# EasyEDA Pro project SONIC_TRANSMITTER.epro

# Schematic Rocket_communication_computer
Board Name: Rocket_communication_computer; Create Date: 2025-08-07; Page Name: Sheet_1; Project Name: SONIC; Schematic Name: Rocket_communication_computer; Update Date: 2025-08-09; Add into BOM: yes; Company: Your Company; Convert to PCB: yes; Date: 2025-07-23; Draw By: davdasujal5215; REV: 1.0; Sheet: 1/1; spicePre: .
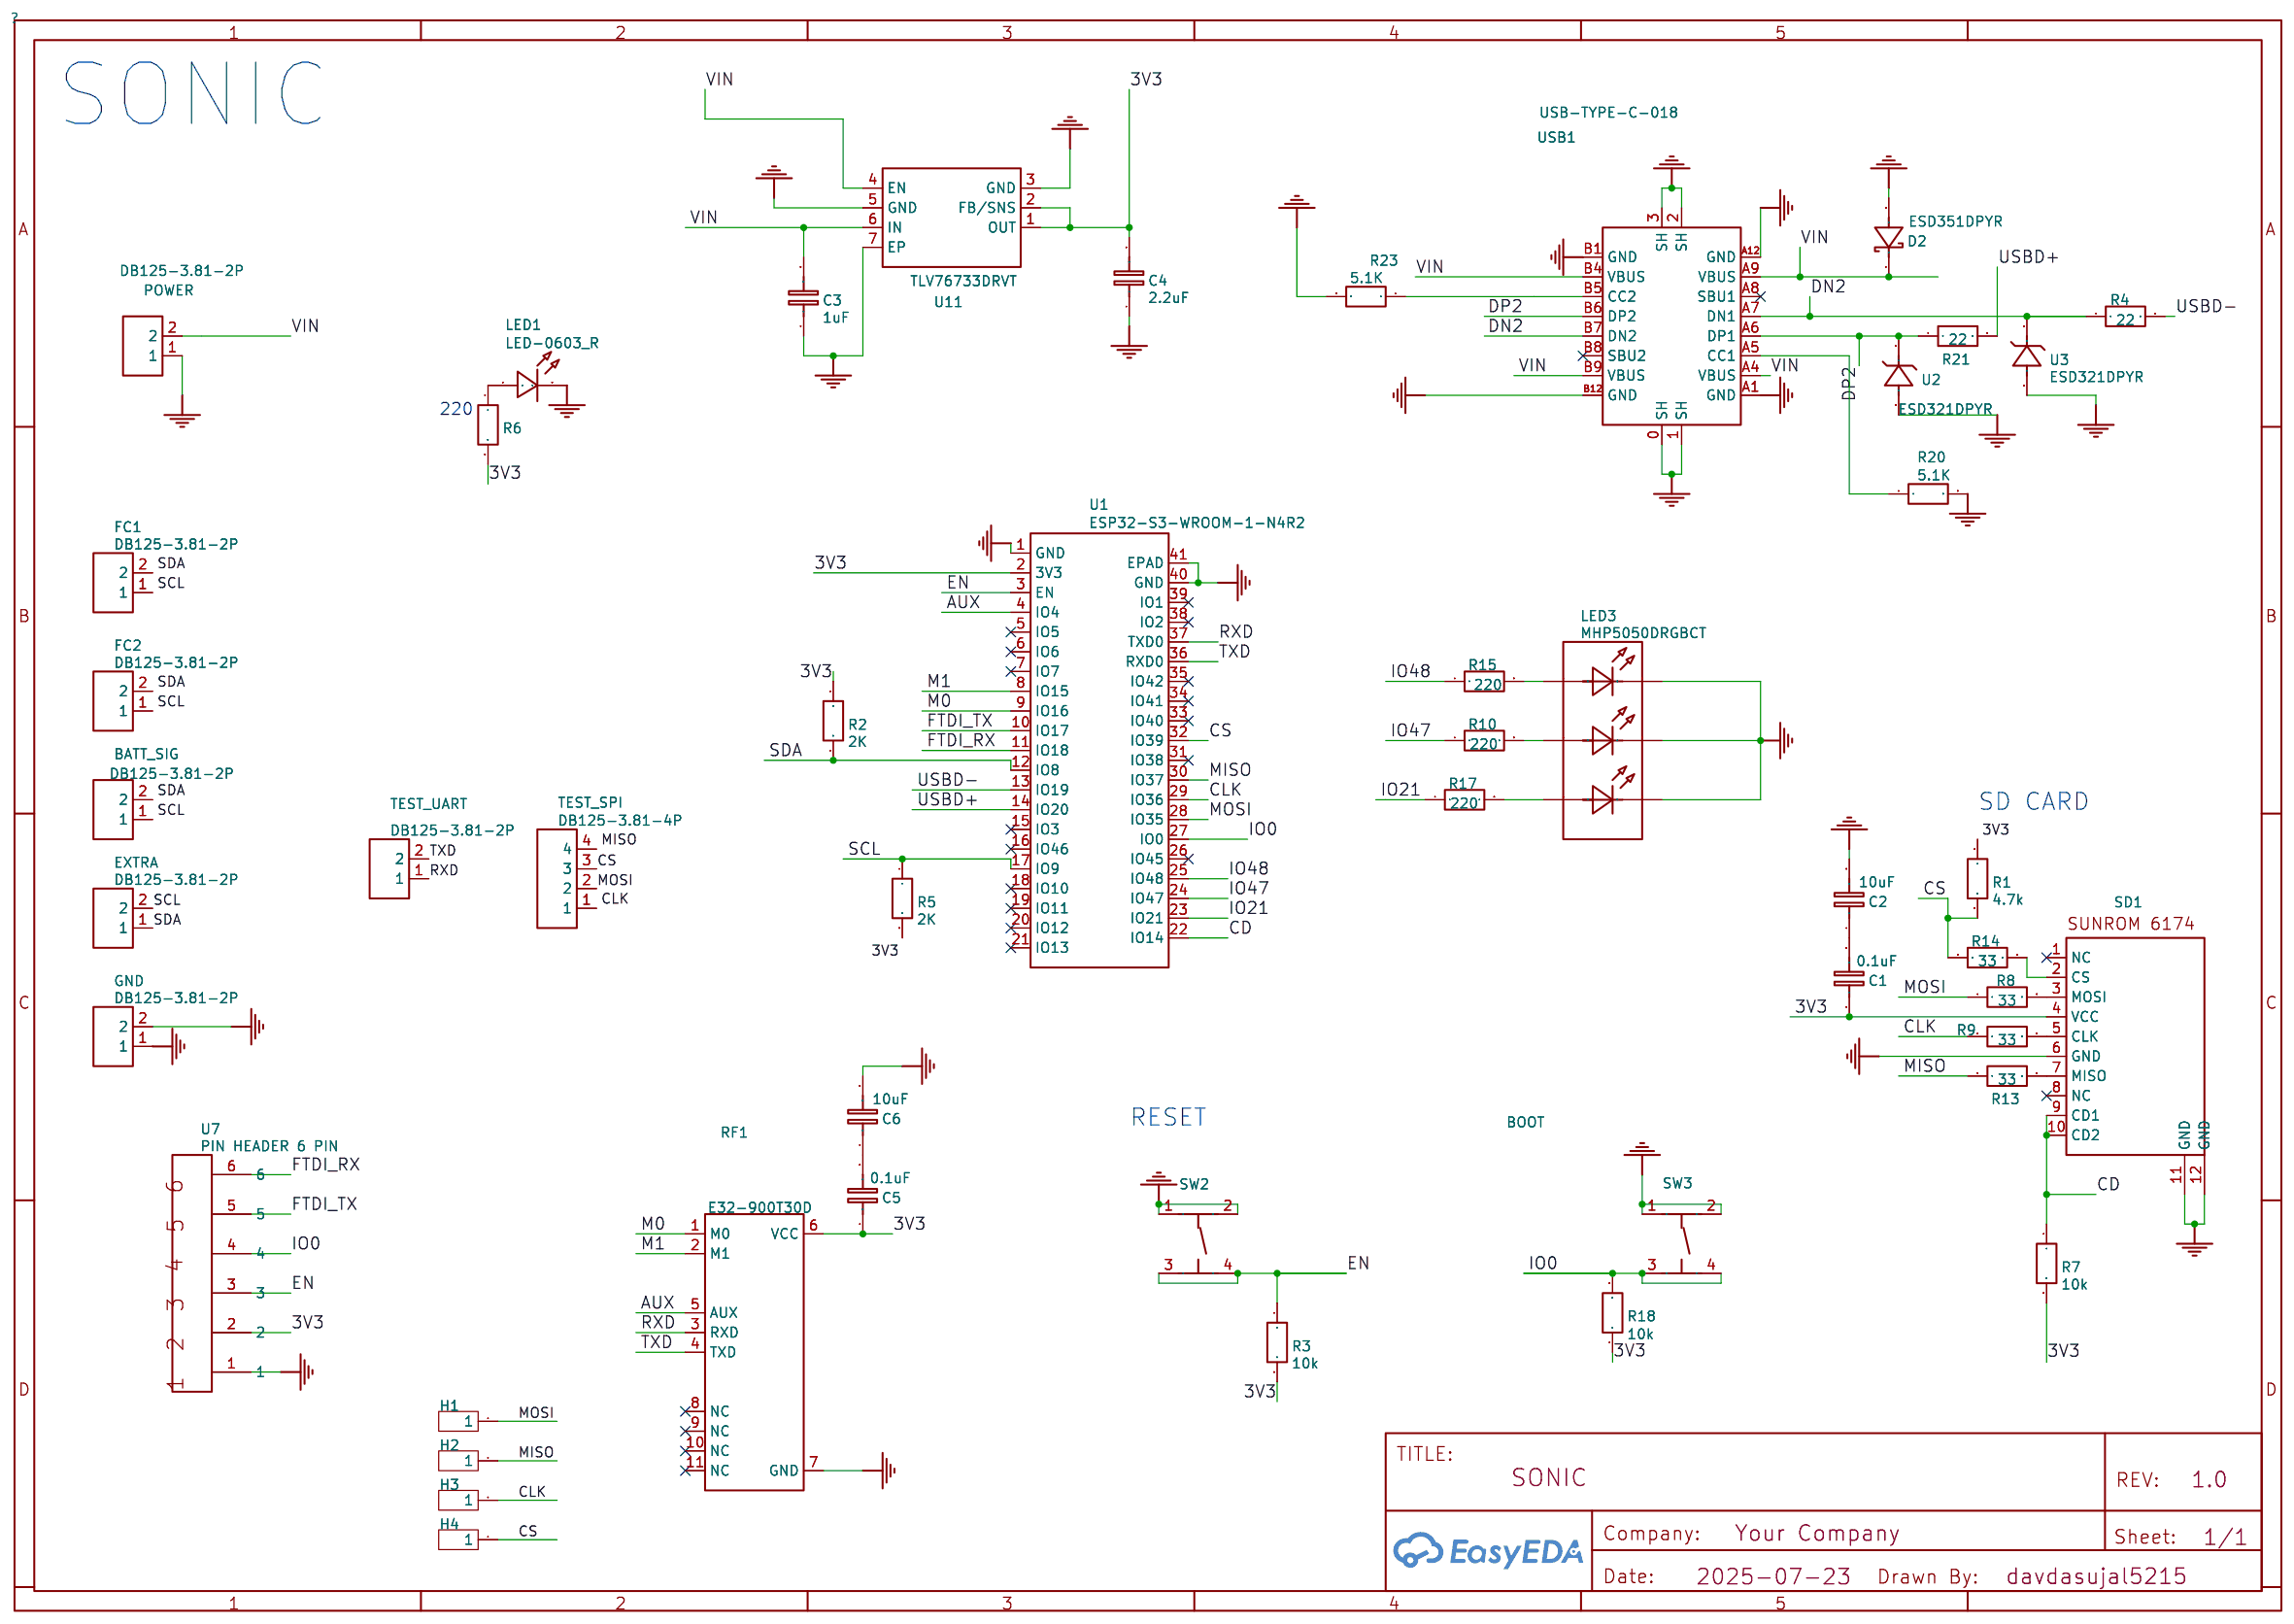
[diagram p0: schematic sheet]

## Parts
BATT_SIG  DB125-3.81-2P  [CONN-TH_2P-P3.81_L7.4-W7.6]
C1  0.1uF  [C0603]
C2  10uF  [C0603]
C3  1uF  [C0603]
C4  2.2uF  [C0603]
C5  0.1uF  [C0603]
C6  10uF  [C0603]
D2  ESD351DPYR  [X1SON-2_L1.0-W0.6-P0.65-RD-1]
EXTRA  DB125-3.81-2P  [CONN-TH_2P-P3.81_L7.4-W7.6]
FC1  DB125-3.81-2P  [CONN-TH_2P-P3.81_L7.4-W7.6]
FC2  DB125-3.81-2P  [CONN-TH_2P-P3.81_L7.4-W7.6]
GND  DB125-3.81-2P  [CONN-TH_2P-P3.81_L7.4-W7.6]
H1  -  [HDR-TH_1P-V-M_XKB_X4611WV-01I-C28D40]
H2  -  [HDR-TH_1P-V-M_XKB_X4611WV-01I-C28D40]
H3  -  [HDR-TH_1P-V-M_XKB_X4611WV-01I-C28D40]
H4  -  [HDR-TH_1P-V-M_XKB_X4611WV-01I-C28D40]
LED1  LED-0603_R  [LED0603_RED]
LED3  MHP5050DRGBCT  [LED-SMD_6P-L5.0-W5.0-P1.60-LS4.4-TL_MHP5050DRGBCT]
POWER  DB125-3.81-2P  [CONN-TH_2P-P3.81_L7.4-W7.6]
R1  4.7k  [R0603]
R2  2K  [R0603]
R3  10k  [R0603]
R4  22  [R0603]
R5  2K  [R0603]
R6  10k  [R0603]
R7  10k  [R0603]
R8  33  [R0603]
R9  33  [R0603]
R10  220  [R0603]
R13  33  [R0603]
R14  33  [R0603]
R15  220  [R0603]
R17  220  [R0603]
R18  10k  [R0603]
R20  5.1K  [R0603]
R21  22  [R0603]
R23  5.1K  [R0603]
RF1  E32-900T30D  [WIRELM-TH_E32-900T30D]
SD1  SUNROM 6174  [SUNROM 6174]
SW2  RESET  [SW-SMD_4P-L4.5-W4.5-P3.00-LS7.0]
SW3  BOOT  [SW-SMD_4P-L4.5-W4.5-P3.00-LS7.0]
TEST_SPI  DB125-3.81-4P  [CONN-TH_DB125-3.81-4P]
TEST_UART  DB125-3.81-2P  [CONN-TH_2P-P3.81_L7.4-W7.6]
U1  ESP32-S3-WROOM-1-N4R2  [WIRELM-SMD_ESP32-S3-WROOM-1]
U2  ESD321DPYR  [X1SON-2_L1.0-W0.6-P0.65-RD]
U3  ESD321DPYR  [X1SON-2_L1.0-W0.6-P0.65-RD]
U7  PIN HEADER 6 PIN  [PINHEADER-6PIN]
U11  TLV76733DRVT  [WSON-6_L2.0-W2.0-P0.65-TL-EP]
USB1  USB-TYPE-C-018  [USB-C_SMD-TYPE-C-31-M-12]

## Library data of the parts
BATT_SIG EXTRA FC1 FC2 GND POWER TEST_UART = DB125-3.81-2P: Supplier: LCSC; Supplier Part: C395878; Manufacturer: DORABO(地博电气); Manufacturer Part: DB125-3.81-2P-GN-S; JLCPCB Part Class: Extended Part; Contributor: LCSC; spicePre: U
C1 C5 = 0.1uF: nameAlias: Value(F); Contributor: LCEDA_Lib; spicePre: C; spiceSymbolName: C_0603_EU
C2 C6 = 10uF: nameAlias: Value(F); Contributor: LCEDA_Lib; spicePre: C; spiceSymbolName: C_0603_EU
C3 = 1uF: nameAlias: Value(F); Contributor: LCEDA_Lib; spicePre: C; spiceSymbolName: C_0603_EU
C4 = 2.2uF: nameAlias: Value(F); Contributor: LCEDA_Lib; spicePre: C; spiceSymbolName: C_0603_EU
D2 = ESD351DPYR: Supplier: LCSC; Supplier Part: C1974929; Manufacturer: TI(德州仪器); JLCPCB Part Class: Extended Part; Contributor: LCSC; spicePre: D
H1-H4 = HDR-M_2.54_1x1P: Supplier Footprint: Through
LED1 = LED-0603_R: Manufacturer: EVERLIGHT(台湾亿光); Manufacturer Part: 19-217/R6C-AL1M2VY/3T; Supplier Part: C72044; Supplier: LCSC; Contributor: LCEDA_01; spicePre: L
LED3 = MHP5050DRGBCT: Supplier: LCSC; Supplier Part: C7470880; Manufacturer: MEIHUA(美华); JLCPCB Part Class: Extended Part; Contributor: lcsc; spicePre: L
R1 = 4.7k: nameAlias: Value(Ω); Contributor: LCEDA_Lib; spicePre: R; spiceSymbolName: R_0603_EU
R2 R5 = 2K: nameAlias: Value(Ω); Contributor: LCEDA_Lib; spicePre: R; spiceSymbolName: R_0603_EU
R3 R6 R7 R18 = 10k: nameAlias: Value(Ω); Contributor: LCEDA_Lib; spicePre: R; spiceSymbolName: R_0603_EU
R4 R21 = 22: nameAlias: Value(Ω); Contributor: LCEDA_Lib; spicePre: R; spiceSymbolName: R_0603_EU
R8 R9 R13 R14 = 33: nameAlias: Value(Ω); Contributor: LCEDA_Lib; spicePre: R; spiceSymbolName: R_0603_EU
R10 R15 R17 = 220: nameAlias: Value(Ω); Contributor: LCEDA_Lib; spicePre: R; spiceSymbolName: R_0603_EU
R20 R23 = 5.1K: nameAlias: Value(Ω); Contributor: LCEDA_Lib; spicePre: R; spiceSymbolName: R_0603_EU
RF1 = E32-900T30D: Supplier: LCSC; Supplier Part: C9900133952; Manufacturer: null; Contributor: lcsc; spicePre: R
SD1 = SUNROM 6174: Contributor: Vanya12345; spicePre: S
SW2 = RESET: Supplier: LCSC; Supplier Part: C397346; Manufacturer: XKB Enterprise; Manufacturer Part: TS-1109S-C-A; JLCPCB Part Class: Extended Part; Contributor: Igor Iks; spicePre: S; spiceSymbolName: TS-1109S-C-A
SW3 = BOOT: Supplier: LCSC; Supplier Part: C397346; Manufacturer: XKB Enterprise; Manufacturer Part: TS-1109S-C-A; JLCPCB Part Class: Extended Part; Contributor: Igor Iks; spicePre: S; spiceSymbolName: TS-1109S-C-A
TEST_SPI = DB125-3.81-4P: Supplier: LCSC; Supplier Part: C395880; Manufacturer: DORABO(地博电气); Manufacturer Part: DB125-3.81-4P-GN-S; JLCPCB Part Class: Extended Part; Contributor: LCSC; spicePre: U
U1 = ESP32-S3-WROOM-1-N4R2: Supplier: LCSC; Supplier Part: C2913203; Manufacturer: ESPRESSIF(乐鑫); JLCPCB Part Class: Extended Part; Contributor: lcsc; spicePre: U
U2 U3 = ESD321DPYR: Supplier: LCSC; Supplier Part: C717890; Manufacturer: null; Contributor: LCSC; spicePre: U
U7 = PIN HEADER 6 PIN: Contributor: iammuria; spicePre: U
U11 = TLV76733DRVT: Supplier: LCSC; Supplier Part: C2867572; Manufacturer: TI(德州仪器); JLCPCB Part Class: Extended Part; Contributor: LCSC; spicePre: U
USB1 = USB-TYPE-C-018: Supplier: LCSC; Supplier Part: C2927038; Manufacturer: DEALON(德艺隆); JLCPCB Part Class: Extended Part; Contributor: LCSC; spicePre: U

## Nets
3V3: C1.1 C4.2 C5.1 R1.1 R2.1 R3.2 R5.2 R6.2 R7.2 R18.1 RF1.6(VCC) SD1.4(VCC) U1.2(3V3) U7.2 U11.1(OUT) U11.2(FB/SNS)
GND: C2.2 C3.1 C4.1 C6.2 D2.2(A) GND.1 GND.2 LED1.2 LED3.4(B-) LED3.5(R-) LED3.6(G-) POWER.1 R20.2 R23.2 RF1.7(GND) SD1.6(GND) SD1.11(GND) SD1.12(GND) SW2.1 SW2.2 SW3.1 SW3.2 U1.1(GND) U1.40(GND) U1.41(EPAD) U2.2(A) U3.2(A) U7.1 U11.3(GND) U11.5(GND) U11.7(EP) USB1.0(SH) USB1.1(SH) USB1.2(SH) USB1.3(SH) USB1.A1(GND) USB1.A12(GND) USB1.B1(GND) USB1.B12(GND)
VIN: C3.2 D2.1(K) POWER.2 U11.4(EN) U11.6(IN) USB1.A4(VBUS) USB1.A9(VBUS) USB1.B4(VBUS) USB1.B9(VBUS)
AUX: RF1.5(AUX) U1.4(IO4)
CD: R7.1 SD1.9(CD1) SD1.10(CD2) U1.22(IO14)
CLK: H3.1 R9.1 TEST_SPI.1 U1.29(IO36)
CS: H4.1 R1.2 R14.1 TEST_SPI.3 U1.32(IO39)
DN2: R4.1 U3.1(K) USB1.A7(DN1) USB1.B7(DN2)
DP2: R21.1 U2.1(K) USB1.A6(DP1) USB1.B6(DP2)
EN: R3.1 SW2.3 SW2.4 U1.3(EN) U7.3
FTDI_RX: U1.11(IO18) U7.6
FTDI_TX: U1.10(IO17) U7.5
IO0: R18.2 SW3.3 SW3.4 U1.27(IO0) U7.4
IO21: R17.1 U1.23(IO21)
IO47: R10.1 U1.24(IO47)
IO48: R15.1 U1.25(IO48)
M0: RF1.1(M0) U1.9(IO16)
M1: RF1.2(M1) U1.8(IO15)
MISO: H2.1 R13.1 TEST_SPI.4 U1.30(IO37)
MOSI: H1.1 R8.1 TEST_SPI.2 U1.28(IO35)
RXD: RF1.3(RXD) TEST_UART.1 U1.37(TXD0)
SCL: BATT_SIG.1 EXTRA.2 FC1.1 FC2.1 R5.1 U1.17(IO9)
SDA: BATT_SIG.2 EXTRA.1 FC1.2 FC2.2 R2.2 U1.12(IO8)
TXD: RF1.4(TXD) TEST_UART.2 U1.36(RXD0)
USBD+: R21.2 U1.14(IO20)
USBD-: R4.2 U1.13(IO19)
$1N37: R14.2 SD1.2(CS)
$1N41: LED3.1(G+) R15.2
$1N65: R20.1 USB1.A5(CC1)
$1N67: R23.1 USB1.B5(CC2)
$1N83: LED3.2(R+) R10.2
$1N84: LED3.3(B+) R17.2
$1N1107: LED1.1 R6.1
$1N1108: R8.2 SD1.3(MOSI)
$1N1109: R9.2 SD1.5(CLK)
$1N1110: R13.2 SD1.7(MISO)
$1N1111: C1.2 C2.1
$1N1118: C5.2 C6.1

Not connected (* = marked no-connect by the designer): RF1 8(NC)* 9(NC)* 10(NC)* 11(NC)*; SD1 1(NC)* 8(NC)*; U1 5(IO5)* 6(IO6)* 7(IO7)* 15(IO3)* 16(IO46)* 18(IO10)* 19(IO11)* 20(IO12)* 21(IO13)* 26(IO45)* 31(IO38)* 33(IO40)* 34(IO41)* 35(IO42)* 38(IO2)* 39(IO1)*; USB1 A8(SBU1)* B8(SBU2)*

## Notes on the sheet
- SONIC
- 220
- SD CARD
- RESET

# Board PCB_Rocket_communication_computer_3
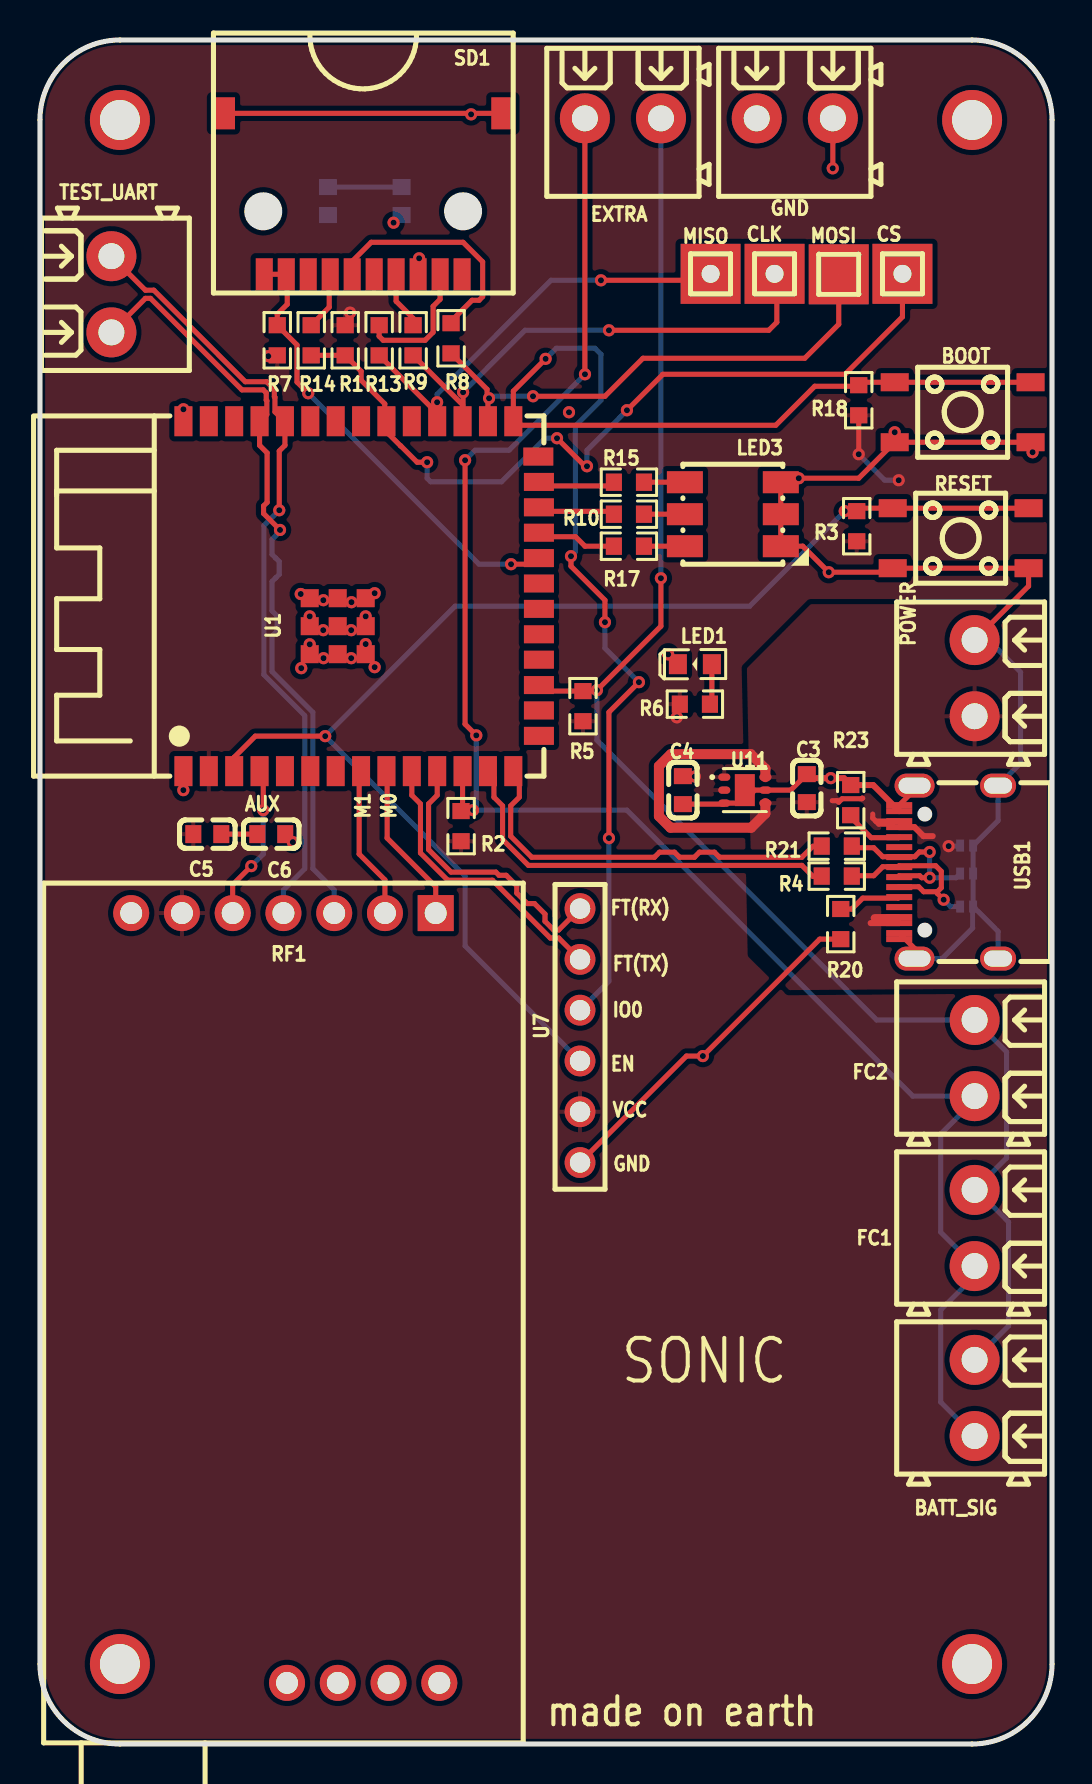
[diagram p1: board, top side]
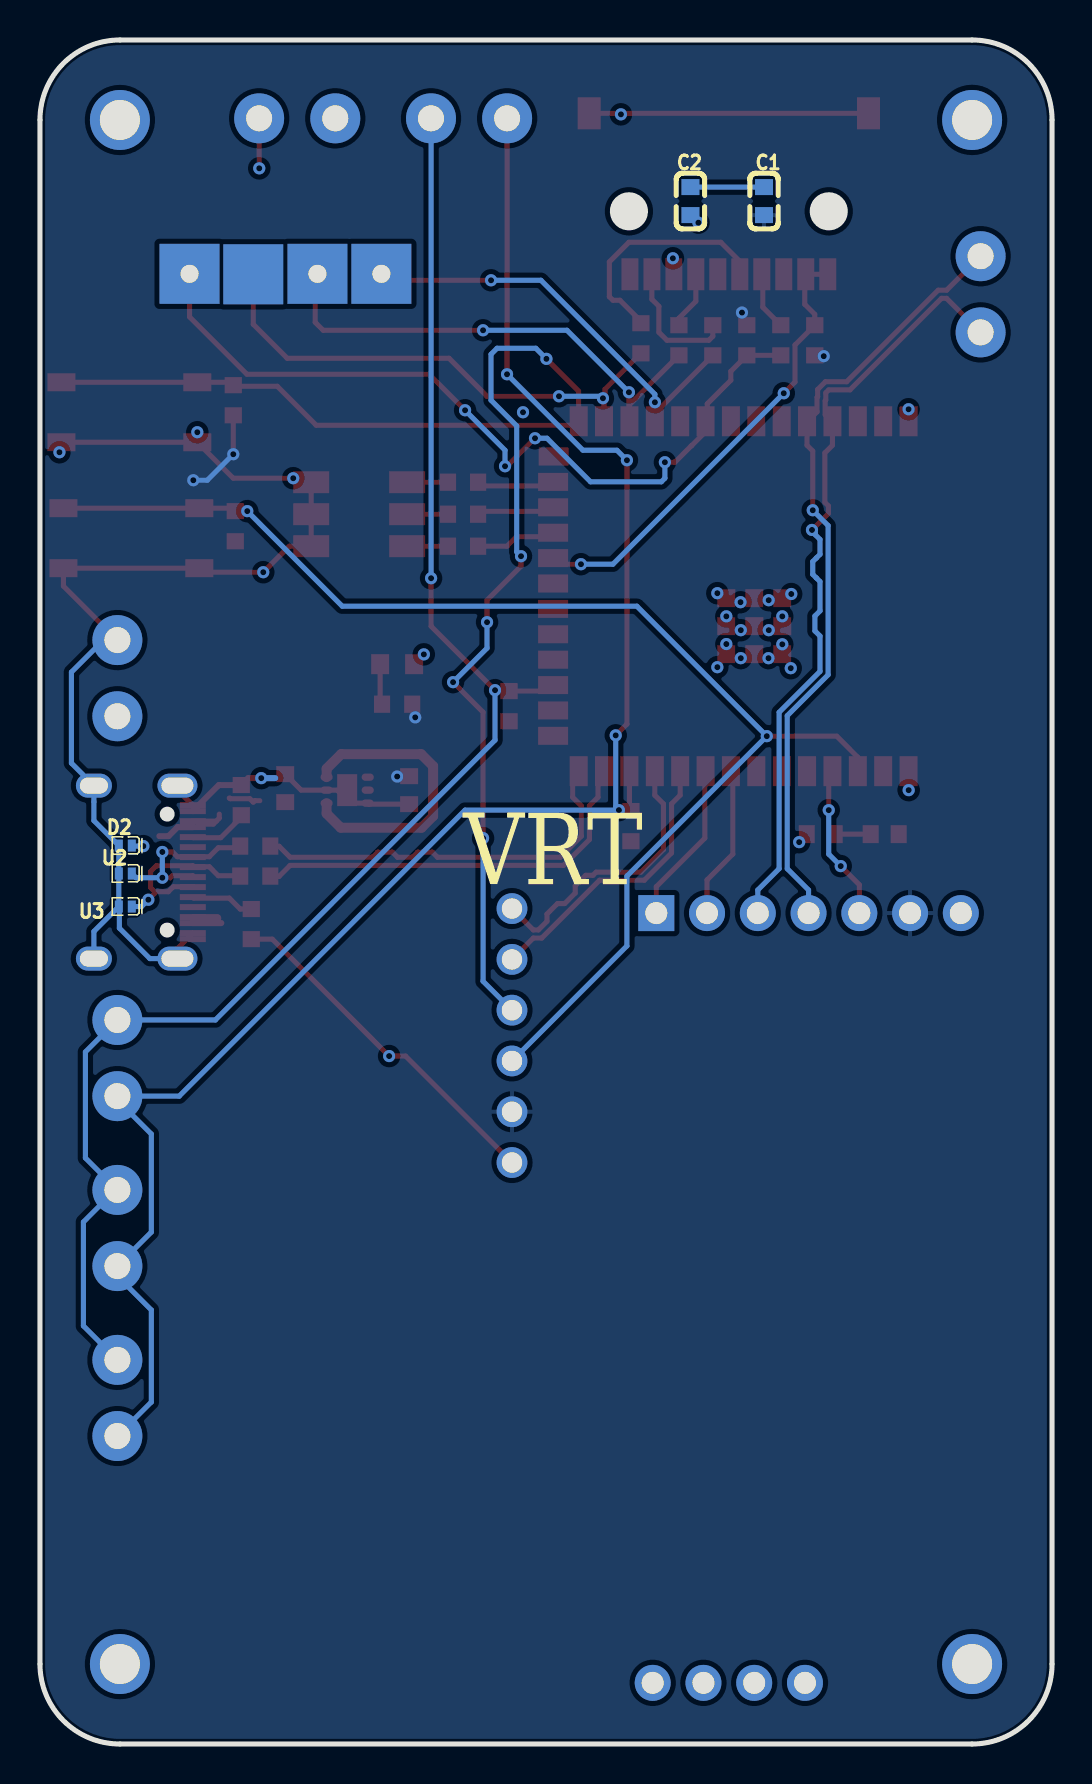
[diagram p2: board, bottom side, seen from below]

Outline 50.65 x 85.23 mm; copper layers: Top Layer, GND, GND2, Bottom Layer. Coordinates in mm from the lower left corner of the outline.
Outline path: 0,81.23 0,4 arc(1.17,1.17) 4,0 46.65,0 arc(49.48,1.17) 50.65,4 50.65,81.23 arc(49.48,84.05) 46.65,85.23 4,85.23 arc(1.17,84.05) 0,81.23
Stack: Top Layer 0.035mm Outer layer thickness 1oz / Dielectric1 0.2104mm 7628 RC49% 8.6mil / GND 0.0152mm Inner layer thickness / Dielectric2 1.065mm 1.1mm H/HOZ Copper / GND2 0.0152mm Inner layer thickness / Dielectric3 0.2104mm 7628 RC49% 8.6mil / Bottom Layer 0.035mm Outer layer thickness 1oz

## Design rules (mm)
net RXD: DP2
net TXD: DP2
net USBD-: DP1
net USBD+: DP1
net FTDI_TX: DP3
net FTDI_RX: DP3
template: JLCPCB Capability(Multiple Layers Board)
spacing copperThickness1oz (default): track to track 0.102, other pairs 0.152 to 0.3
spacing copperThickness2oz: track to track 0.203, other pairs 0.152 to 0.3
spacing copperThicknessInner0.5oz: track to track 0.089, other pairs 0.152 to 0.3
track width copperThickness1oz (default): min 0.102, default 0.254, max 2.54
track width copperThickness0.5oz: min 0.089, default 0.254, max 2.54
track width copperThickness2oz: min 0.203, default 0.254, max 2.54
differential pair differentialPair (default): width min 0.127, default 0.254, max 2.54; gap min 0.152, default 0.152
via viaSize (default): diameter min 0.3, default 0.61, max 10; hole min 0.2, default 0.305, max 6.3

## Placement (name value [footprint] x y rotation side)
BATT_SIG  DB125-3.81-2P  [CONN-TH_2P-P3.81_L7.4-W7.6]  46.78 17.31 270 top
BOOT  BOOT  [SW-SMD_4P-L4.5-W4.5-P3.00-LS7.0]  46.18 66.61 180 top
C1  0.1uF  [C0603]  14.41 77.17 90 bottom
C2  10uF  [C0603]  18.1 77.17 270 bottom
C3  1uF  [C0603]  38.38 47.81 270 top
C4  2.2uF  [C0603]  32.18 47.71 90 top
C5  0.1uF  [C0603]  8.38 45.51 0 top
C6  10uF  [C0603]  11.57 45.51 0 top
CLK  -  [HDR-TH_1P-V-M_XKB_X4611WV-01I-C28D40]  36.76 73.53 0 top
CS  -  [HDR-TH_1P-V-M_XKB_X4611WV-01I-C28D40]  43.16 73.53 180 top
D2  ESD351DPYR  [X1SON-2_L1.0-W0.6-P0.65-RD-1]  46.38 44.94 0 bottom
EXTRA  DB125-3.81-2P  [CONN-TH_2P-P3.81_L7.4-W7.6]  29.18 81.31 0 top
FC1  DB125-3.81-2P  [CONN-TH_2P-P3.81_L7.4-W7.6]  46.78 25.81 270 top
FC2  DB125-3.81-2P  [CONN-TH_2P-P3.81_L7.4-W7.6]  46.78 34.31 270 top
GND  DB125-3.81-2P  [CONN-TH_2P-P3.81_L7.4-W7.6]  37.78 81.31 0 top
LED1  LED-0603_R  [LED0603_RED]  32.78 54.01 180 top
LED3  MHP5050DRGBCT  [LED-SMD_6P-L5.0-W5.0-P1.60-LS4.4-TL_MHP5050DRGBCT]  34.68 61.51 0 top
MISO  -  [HDR-TH_1P-V-M_XKB_X4611WV-01I-C28D40]  33.56 73.53 180 top
MOSI  -  [HDR-TH_1P-V-M_XKB_X4611WV-01I-C28D40#2]  39.97 73.51 0 top
NOREF  -  [Pad_e596]  4 4 0 top
NOREF#2  -  [Pad_e594]  46.65 81.23 0 top
NOREF#3  -  [Pad_e11]  46.65 4 0 top
NOREF#4  -  [Pad_e595]  4 81.23 0 top
POWER  DB125-3.81-2P  [CONN-TH_2P-P3.81_L7.4-W7.6]  46.78 53.31 270 top
R1  4.7k  [R0603]  15.28 70.21 270 top
R2  2K  [R0603]  21.07 45.91 90 top
R3  10k  [R0603]  40.88 60.91 270 top
R4  22  [R0603]  39.88 43.41 180 top
R5  2K  [R0603]  27.18 51.91 270 top
R6  10k  [R0603]  32.78 52.01 180 top
R7  10k  [R0603]  11.88 70.21 270 top
R8  33  [R0603]  20.57 70.31 90 top
R9  33  [R0603]  18.68 70.21 90 top
R10  220  [R0603]  29.47 61.51 0 top
R13  33  [R0603]  16.97 70.21 90 top
R14  33  [R0603]  13.57 70.21 90 top
R15  220  [R0603]  29.47 63.11 0 top
R17  220  [R0603]  29.47 59.91 0 top
R18  10k  [R0603]  40.97 67.21 90 top
R20  5.1K  [R0603]  40.07 41.01 270 top
R21  22  [R0603]  39.88 44.91 180 top
R23  5.1K  [R0603]  40.57 47.21 90 top
RESET  RESET  [SW-SMD_4P-L4.5-W4.5-P3.00-LS7.0]  46.07 60.31 180 top
RF1  E32-900T30D  [WIRELM-TH_E32-900T30D]  12.28 22.31 0 top
SD1  -  [SUNROM 6174]  16.18 73.51 0 top
TEST_UART  DB125-3.81-2P  [CONN-TH_2P-P3.81_L7.4-W7.6]  3.58 72.51 90 top
U1  ESP32-S3-WROOM-1-N4R2  [WIRELM-SMD_ESP32-S3-WROOM-1]  16.07 57.41 90 top
U2  ESD321DPYR  [X1SON-2_L1.0-W0.6-P0.65-RD]  46.38 43.54 0 bottom
U3  ESD321DPYR  [X1SON-2_L1.0-W0.6-P0.65-RD]  46.38 41.89 0 bottom
U7  PIN HEADER 6 PIN  [PINHEADER-6PIN]  27.03 29.08 90 top
U11  TLV76733DRVT  [WSON-6_L2.0-W2.0-P0.65-TL-EP]  35.28 47.71 0 top
USB1  USB-TYPE-C-018  [USB-C_SMD-TYPE-C-31-M-12]  45.47 43.61 90 top

## Footprints (pads in the part's own frame, mm; a bottom-side part is the same pattern mirrored in y, then rotated)
C0603
  rect 0.8x0.9 smd: 1(-0.7,0) 2(0.7,0)
CONN-TH_2P-P3.81_L7.4-W7.6
  round 2.5 hole 1.3: 1(-1.905,0) 2(1.905,0)
HDR-TH_1P-V-M_XKB_X4611WV-01I-C28D40
  rect 3x3 hole 0.9x0.003: 1(0,0)
HDR-TH_1P-V-M_XKB_X4611WV-01I-C28D40#2
  rect 3x3 hole 0.003: 1(0,0)
LED0603_RED
  rect 0.9x1 smd: 1(-0.85,0) 2(0.85,0)
LED-SMD_6P-L5.0-W5.0-P1.60-LS4.4-TL_MHP5050DRGBCT
  rect 1.8x1.1 smd: 1(-2.4,1.6) 2(-2.4,0) 3(-2.4,-1.6) 4(2.4,-1.6) 5(2.4,0) 6(2.4,1.6)
Pad_e11
  round 3 hole 2: 1(0,0)
Pad_e594
  round 3 hole 2: 1(0,0)
Pad_e595
  round 3 hole 2: 1(0,0)
Pad_e596
  round 3 hole 2: 1(0,0)
PINHEADER-6PIN
  round 1.54 hole 1.02: 1(0,0) 2(2.54,0) 3(5.08,0) 4(7.62,0) 5(10.16,0) 6(12.7,0)
R0603
  rect 0.806x0.864 smd: 1(-0.753,0) 2(0.753,0)
SUNROM 6174
  custom 0.85x1.6 smd: 1(-2.75,0) 2(-1.65,0) 3(-0.55,0) 4(0.55,0) 5(1.65,0) 6(2.75,0) 7(3.85,0) 8(4.95,0) 9(-4.95,0) 10(-3.85,0)
  custom 1.15x1.6 smd: 11(-6.99,8.05) 12(6.99,8.05)
SW-SMD_4P-L4.5-W4.5-P3.00-LS7.0
  rect 1.4x0.9 smd: 1(-3.4,1.5) 2(3.4,1.5) 3(-3.4,-1.5) 4(3.4,-1.5)
USB-C_SMD-TYPE-C-31-M-12
  oval 1.2x2 hole 0.8x1.6: 0(-4.325,1.706) 1(4.325,1.706)
  oval 1.2x1.8 hole 0.8x1.4: 2(4.325,-2.474) 3(-4.325,-2.474)
  rect 0.3x1.3 smd: A1(-3.35,2.474) A4(-2.55,2.474) A5(-1.25,2.474) A6(-0.25,2.474) A7(0.25,2.474) A8(1.25,2.474) A9(2.55,2.474) A12(3.35,2.474) B1(3.05,2.474) B4(2.25,2.474) B5(1.75,2.474) B6(0.75,2.474) B7(-0.75,2.474) B8(-1.75,2.474) B9(-2.25,2.474) B12(-3.05,2.474)
WIRELM-SMD_ESP32-S3-WROOM-1
  rect 1.5x0.9 smd: 1(-8.75,8.895) 2(-8.75,7.625) 3(-8.75,6.355) 4(-8.75,5.085) 5(-8.75,3.815) 6(-8.75,2.545) 7(-8.75,1.275) 8(-8.75,0.005) 9(-8.75,-1.265) 10(-8.75,-2.535) 11(-8.75,-3.805) 12(-8.75,-5.075) 13(-8.75,-6.345) 14(-8.75,-7.615) 27(8.75,-7.615) 28(8.75,-6.345) 29(8.75,-5.075) 30(8.75,-3.805) 31(8.75,-2.535) 32(8.75,-1.265) 33(8.75,0.005) 34(8.75,1.275) 35(8.75,2.545) 36(8.75,3.815) 37(8.75,5.085) 38(8.75,6.355) 39(8.75,7.625) 40(8.75,8.895)
  rect 0.9x1.5 smd: 15(-6.985,-8.895) 16(-5.715,-8.895) 17(-4.445,-8.895) 18(-3.175,-8.895) 19(-1.905,-8.895) 20(-0.635,-8.895) 21(0.635,-8.895) 22(1.905,-8.895) 23(3.175,-8.895) 24(4.445,-8.895) 25(5.715,-8.895) 26(6.985,-8.865)
  rect 0.9x0.9 smd: 41(-2.9,2.575) 41(-2.9,1.175) 41(-2.9,-0.225) 41(-1.5,2.575) 41(-1.5,1.175) 41(-1.5,-0.226) 41(-0.1,2.575) 41(-0.1,1.175) 41(-0.1,-0.225)
WIRELM-TH_E32-900T30D
  rect 1.8x1.8 hole 1.1: 1(7.53,19.25)
  round 1.8 hole 1.1: 2(4.99,19.25) 3(2.45,19.25) 4(-0.09,19.25) 5(-2.63,19.25) 6(-5.17,19.25) 7(-7.71,19.25) 8(0.09,-19.25) 9(2.63,-19.25) 10(5.17,-19.25) 11(7.71,-19.25)
WSON-6_L2.0-W2.0-P0.65-TL-EP
  oval 0.607x0.364 smd: 1(-1.028,0.65) 2(-1.028,0) 3(-1.028,-0.65) 4(1.028,-0.65) 5(1.028,0) 6(1.028,0.65)
  rect 1x1.6 smd: 7(0,0)
X1SON-2_L1.0-W0.6-P0.65-RD
  rect 0.4x0.6 smd: 1(-0.325,0) 2(0.325,0)
X1SON-2_L1.0-W0.6-P0.65-RD-1
  rect 0.4x0.6 smd: 1(-0.325,0) 2(0.325,0)

## Nets
As in the schematic, except:
GND: BOOT.1 BOOT.2 C2.2 C3.1 C4.1 C6.2 D2.2 GND.1 GND.2 LED1.2 LED3.4 LED3.5 LED3.6 POWER.1 R20.2 R23.2 RESET.1 RESET.2 RF1.7 SD1.6 SD1.11 SD1.12 U1.1 U1.40 U1.41 U2.2 U3.2 U7.1 U11.3 U11.5 U11.7 USB1.0 USB1.1 USB1.2 USB1.3 USB1.A1 USB1.A12 USB1.B1 USB1.B12
CLK: CLK.1 R9.1 U1.29
CS: CS.1 R1.2 R14.1 U1.32
EN: R3.1 RESET.3 RESET.4 U1.3 U7.3
IO0: BOOT.3 BOOT.4 R18.2 U1.27 U7.4
MISO: MISO.1 R13.1 U1.30
MOSI: MOSI.1 R8.1 U1.28

Pads without a net: NOREF 1; NOREF#2 1; NOREF#3 1; NOREF#4 1; RF1 8 9 10 11; SD1 1 8; U1 5 6 7 15 16 18 19 20 21 26 31 33 34 35 38 39; USB1 A8 B8

## Via types
v1: diameter 0.61, hole 0.305, Top Layer to Bottom Layer, 68 vias

## Routing (per net, layer and track width the routed paths; a pad name or vN(x,y) marks a point on that pad's centre or on a via; arc(x,y) is an arc through that point)
3V3: length 4.5
  Top Layer w0.254: R18.1 v1(40.97,64.51)
  Bottom Layer w0.254: v1(40.97,64.51) 42.28,63.21 v1(42.97,63.21)
  vias: v1(11.43,69.41) v1(15.52,71.59) v1(31.87,51.35) v1(32.77,48.39)
GND: length 105.9
  Top Layer w0.254: v1(37.97,63.31) 40.97,63.31 BOOT.2 BOOT.1 ; C3.1 37.57,47.71 U11.5 35.78,47.71 35.12,47.06 U11.3 34.2,47.01 C4.1 ; USB1.B12 43.77,39.79 43.77,39.28 ; SD1.12 21.62,81.56 v1(21.57,81.51) 21.53,81.56 SD1.11 ; USB1.1 43.77,47.73 USB1.A12 ; LED3.6 LED3.5 LED3.4 38.18,59.91 v1(39.47,58.61) 42.47,58.61 RESET.2 RESET.1 49.47,57.91 POWER.1 ; GND.2 39.68,78.81 v1(39.68,78.81) ; R20.2 39.02,40.25 v1(33.18,34.41) 32.35,34.41 U7.1
  Top Layer w0.3: USB1.B1 41.7,47.96 R23.2 40.23,48.31 v1(39.57,48.31) ; 38.88,48.31 39.38,48.31
  Bottom Layer w0.254: 47.95,39.28 47.95,40.64 U3.2 ; U3.2 46.68,41.86 46.68,40.81 45.15,39.28 43.77,39.28 ; U3.2 U2.2 D2.2 47.95,46.18 USB1.2 49.07,49.06 49.07,53.61 47.47,55.21 POWER.1
  Bottom Layer w0.3: v1(39.57,48.31) 38.88,48.31
  vias: v1(7.18,66.76) v1(7.17,47.71) v1(12.66,45.11) v1(13.05,57.52) v1(13.07,53.81) v1(13.5,56.4) v1(13.5,55) v1(14.18,57.21) v1(14.18,55.71) v1(14.19,54.31) v1(15.59,57.11) v1(15.57,55.71) v1(15.57,54.31) v1(16.3,56.4) v1(16.3,55.01) v1(16.75,57.56) v1(16.75,53.86) v1(17.7,76.09) v1(18.97,74.31) v1(31.44,54.5) v1(42.78,65.61) v1(49.68,64.61)
VIN: length 24.7
  Top Layer w0.254: USB1.A9 41.82,46.16 ; 41.82,46.16 41.97,46.01 42.68,46.01 ; 41.82,46.16 41.68,46.31 41.68,46.51 ; 41.18,47.31 41.15,47.31 41.12,47.28 40.15,47.28 39.97,47.11 39.9,47.18 39.65,47.18 ; USB1.B4 42.68,45.86
  Top Layer w0.3: USB1.B4 43.76,45.86 44.21,45.41 44.68,45.41
  Top Layer w0.305: USB1.A4 41.57,41.06
  Top Layer w0.4: 42.95,41.31 41.78,41.31
  Top Layer w0.5: U11.4 36.3,46.54 35.6,45.83 31.55,45.83 30.97,46.41 30.97,48.91 31.57,49.51 35.57,49.51 36.3,48.78 U11.6
  Bottom Layer w0.254: D2.1 46.03,44.91 v1(45.47,44.91)
(no net):
  vias: v1(26.47,66.61)
AUX: length 7.7
  Top Layer w0.254: 10.99,48.46 11.18,48.27 v1(11.18,46.71) ; 9.64,41.46 9.64,42.98 v1(10.57,43.91)
  Bottom Layer w0.254: v1(11.18,46.71) 11.18,44.51 v1(10.57,43.91)
CD: length 23.3
  Top Layer w0.254: v1(13.43,67.56) 12.86,68.12 12.86,69.97 R7.1 11.88,71.51 12.38,72.01 12.38,73.46 SD1.10 SD1.9 ; v1(23.57,59.01) 25.26,59.01 25.27,59.01
  Bottom Layer w0.254: v1(13.43,67.56) 21.97,59.01 v1(23.57,59.01)
CLK: length 25.8
  Top Layer w0.254: CLK.1 36.88,73.42 36.88,71.11 36.47,70.71 v1(28.47,70.71) ; R9.1 21.15,66.98 21.15,65.96 21.18,65.98 v1(21.18,67.61)
  Bottom Layer w0.254: v1(28.47,70.71) 24.28,70.71 v1(21.18,67.61)
CS: length 40.9
  Top Layer w0.254: v1(25.88,65.31) 27.28,63.91 v1(27.38,63.91) ; R14.1 R1.2 16.07,68.65 16.07,68.21 17.25,67.03 17.25,66.04 17.34,65.96 17.34,65.63 18.04,64.93 18.05,64.93 18.88,64.11 v1(19.38,64.11) ; CS.1 43.16,71.38 40.29,68.51 31.18,68.51 v1(29.38,66.71)
  Bottom Layer w0.254: v1(29.38,66.71) 27.38,64.71 v1(27.38,63.91) ; v1(19.38,64.11) 19.38,63.31 19.55,63.13 23.1,63.13 25.28,65.31 v1(25.88,65.31)
DN2: length 9.3
  Top Layer w0.254: 40.84,43.4 40.88,43.43 41.72,43.43 42.18,43.88 42.95,43.88 43,43.93 44.82,43.93 45.11,43.64 45.11,42.83 44.91,42.63 ; 44.91,42.63 44.91,42.54 v1(45.22,42.23) ; 44.91,42.63 44.22,42.63 43.97,42.88 42.95,42.88
  Bottom Layer w0.254: v1(45.22,42.23) 45.57,41.89 U3.1
DP2: length 8.6
  Top Layer w0.254: v1(44.53,43.33) 44.12,43.33 44.03,43.43 43,43.43 42.95,43.38 ; v1(44.53,44.62) 44.01,44.62 43.78,44.38 42.18,44.38 41.72,44.83 40.91,44.83 40.84,44.9
  Bottom Layer w0.254: 44.43,44.62 44.53,44.52 v1(44.53,43.33) 45.84,43.33 U2.1
EN: length 67.3
  Top Layer w0.254: v1(40.28,61.66) R3.1 41.02,61.81 RESET.4 RESET.3 ; 9.72,48.46 9.72,49.35 10.78,50.41 v1(14.28,50.41)
  Bottom Layer w0.254: v1(40.28,61.66) 35.52,56.91 20.78,56.91 v1(14.28,50.41) 21.28,43.41 21.28,39.92 U7.3
FTDI_RX: length 14
  Top Layer w0.254: U7.6 25.96,40.72 25.71,40.72 25.28,41.15 25.28,41.51 24.75,42.03 24.39,42.03 23.86,42.56 23.86,42.92 23.33,43.45 22.97,43.45 22.81,43.61 20.57,43.61 19.45,44.74 19.45,47.02 19.88,47.45 19.88,48.46
FTDI_TX: length 14.3
  Top Layer w0.254: U7.5 25.96,40.31 25.54,40.31 22.65,43.2 20.41,43.2 19.04,44.57 19.04,47.02 18.61,47.45 18.61,48.46
IO0: length 69.9
  Top Layer w0.254: v1(28.47,45.31) 28.47,51.61 v1(29.97,53.11) ; v1(25.3,69.28) 23.69,67.66 23.69,65.96 36.82,65.96 38.78,67.91 40.92,67.91 R18.2 41.12,68.11 BOOT.4 BOOT.3 ; v1(28.28,56.11) 28.28,57.21 26.57,58.91 v1(26.57,59.41)
  Bottom Layer w0.254: U7.4 28.47,38.15 v1(28.47,45.31) ; v1(25.3,69.28) 25.83,69.81 27.78,69.81 28.07,69.51 28.07,67.21 26.79,65.92 26.79,59.62 v1(26.57,59.41) ; v1(28.28,56.11) 28.28,54.81 v1(29.97,53.11)
IO21: length 3.9
  Top Layer w0.254: 24.97,60.38 26.8,60.38 27.28,59.91 R17.1
IO47: length 3.8
  Top Layer w0.254: R10.1 28.58,61.65 24.97,61.65
IO48: length 3.8
  Top Layer w0.254: 24.97,62.92 28.54,62.92 R15.1
M0: length 7.9
  Top Layer w0.254: 17.34,48.46 17.38,48.42 17.38,45.31 19.81,42.88 RF1.1
M1: length 7.5
  Top Layer w0.254: RF1.2 17.26,43.22 15.97,44.51 15.97,48.36 16.07,48.46
MISO: length 21.8
  Top Layer w0.254: MISO.1 33.24,73.21 v1(28.07,73.21) ; 19.88,65.96 19.88,65.96 19.88,66.55 ; R13.1 19.88,66.55 ; 19.88,66.55 v1(19.88,67.11)
  Bottom Layer w0.254: v1(19.88,67.11) 19.88,67.51 25.57,73.21 v1(28.07,73.21)
MOSI: length 25.9
  Top Layer w0.254: v1(24.68,67.41) 28.28,67.41 30.18,69.31 38.28,69.31 39.97,71.01 MOSI.1 ; 22.42,65.96 22.42,67.25 v1(22.47,67.31) ; 22.38,67.31 22.38,67.75 R8.1
  Bottom Layer w0.254: v1(24.68,67.41) 22.57,67.41 v1(22.47,67.31)
RXD: length 39.1
  Top Layer w0.254: v1(12.01,60.72) 11.19,61.54 11.19,61.92 11.37,62.1 11.37,64.58 10.99,64.95 10.99,66.13 11.35,66.49 11.35,67.19 11.32,67.22 11.32,67.58 11.18,67.73 10.11,67.73 5.53,72.31 5.28,72.31 TEST_UART.1
  Bottom Layer w0.254: v1(12.01,60.72) 11.84,60.55 11.84,60.48 11.61,60.25 11.61,59.5 11.79,59.32 11.8,59.32 11.97,59.14 11.97,58.5 11.8,58.32 11.79,58.32 11.61,58.14 11.61,56.67 11.87,56.42 11.87,55.67 11.61,55.42 11.61,53.65 13.66,51.6 13.66,43.78 14.72,42.71 RF1.3
SCL: length 79.9
  Top Layer w0.254: 24.97,52.76 25.07,52.66 R5.1 27.83,52.66 v1(27.88,52.71) 31.07,55.91 v1(31.07,58.31)
  Bottom Layer w0.254: v1(31.07,58.31) 31.07,81.3 EXTRA.2 ; 46.78,19.21 48.47,20.91 48.47,26.11 46.87,27.71 FC1.1 48.38,29.31 48.38,34.61 FC2.1 41.87,36.21 27.88,50.21 v1(27.88,52.71)
SDA: length 91.7
  Top Layer w0.254: v1(27.28,68.51) 27.27,68.51 EXTRA.1 ; 21.15,48.46 21.15,46.74 R2.2 21.63,46.66 v1(21.68,46.71) ; v1(21.28,64.21) 21.28,51.01 v1(21.84,50.45)
  Bottom Layer w0.254: v1(21.28,64.21) 21.78,64.71 23.47,64.71 v1(27.28,68.51) ; BATT_SIG.2 45.07,17.1 45.07,21.71 46.78,23.41 FC1.2 45.07,25.6 45.07,30.51 46.78,32.21 FC2.2 43.68,32.4 29.38,46.71 v1(21.68,46.71) 21.84,46.87 v1(21.84,50.45)
TXD: length 39.3
  Top Layer w0.254: 12.34,66.04 12.54,65.84 ; TEST_UART.2 5.28,72.71 5.7,72.71 10.28,68.13 11.34,68.13 11.73,67.75 11.73,67.39 11.76,67.35 11.76,66.63 12.26,66.13 12.26,64.95 11.97,64.67 v1(11.97,61.71)
  Bottom Layer w0.254: v1(11.97,61.71) 11.21,60.94 11.21,53.48 13.25,51.43 13.25,43.78 12.19,42.71 RF1.4
USBD+: length 20
  Top Layer w0.254: 39.34,44.9 38.68,44.9 38.13,44.35 34.01,44.35 33.75,44.61 33.01,44.61 32.75,44.35 32.01,44.35 31.75,44.61 31.01,44.61 30.75,44.35 24.61,44.35 23.56,45.41 23.56,46.92 23.99,47.35 23.99,48.36
USBD-: length 20.2
  Top Layer w0.254: 22.72,48.36 22.72,47.35 23.15,46.92 23.15,45.24 24.44,43.94 38.13,43.94 38.68,43.4 39.34,43.4
$1N37: length 2.9
  Top Layer w0.254: R14.2 14.47,71.86 14.47,73.46 SD1.2
$1N41: length 2
  Top Layer w0.254: R15.2 LED3.1
$1N65: length 3.2
  Top Layer w0.254: USB1.A5 42.95,42.31 41.18,42.31 40.63,41.76 R20.1
$1N67: length 3
  Top Layer w0.254: USB1.B5 42.97,45.33 41.6,45.33 40.57,46.35 R23.1
$1N83: length 2
  Top Layer w0.254: R10.2 LED3.2
$1N84: length 2
  Top Layer w0.254: R17.2 LED3.3
$1N1107: length 2
  Top Layer w0.254: R6.1 33.62,52.11 LED1.1
$1N1108: length 12.1
  Top Layer w0.254: 20.38,70.96 21.62,72.21 21.97,72.21 22.15,72.39 22.15,74.13 21.18,75.11 16.57,75.11 15.62,74.16 SD1.3
$1N1109: length 2.9
  Top Layer w0.254: R9.2 18.68,71.31 17.82,72.16 SD1.5
$1N1110: length 6.5
  Top Layer w0.254: SD1.7 20.03,72.26 19.68,71.91 19.68,70.61 19.28,70.21 17.18,70.21 16.97,70.41 R13.2
$1N1111: length 3.7
  Bottom Layer w0.254: C1.2 C2.1
$1N1118: length 1.8
  Top Layer w0.254: C5.2 C6.1

## Copper pours and planes (outline as drawn; the poured copper is in the pictures)
3V3 on Top Layer: -1.22,87.11 -1.22,-0.29 -1.42,-0.49 51.78,-0.49 52.18,-0.09 52.18,86.31 52.38,86.51 51.78,87.11
3V3 on Bottom Layer: -3.92,87.91 -3.92,-9.69 -1.12,-12.49 56.97,-12.49 57.18,-12.29 57.18,84.81 54.43,87.56 -3.57,87.56
GND on Top Layer: 54.57,-2.69 54.57,89.81 -5.22,89.81 -5.22,-1.19 -2.22,-4.19 53.07,-4.19
GND on GND: 0.26,84.97 50.39,84.97 50.39,0.26 0.26,0.26
GND on GND2: 0.26,84.97 50.39,84.97 50.39,0.26 0.26,0.26
VIN on Top Layer: 35.68,39.51 37.47,37.73 37.47,37.71 51.88,37.81 55.38,41.31 55.38,52.81 51.18,57.01 38.57,57.01 35.38,53.81

Small or netless copper shapes (teardrops, artwork), in the pictures only: 1 on Top Layer, 36 on GND, 36 on GND2

## Text on the board
Bottom Silkscreen Layer: VRT
Top Silkscreen Layer: M1 | M0 | AUX | FT(RX) | EN | IO0 | VCC | FT(TX) | GND | made on earth | SONIC
